# EAGLE design MSO-demo-board (EAGLE 6.5.0)
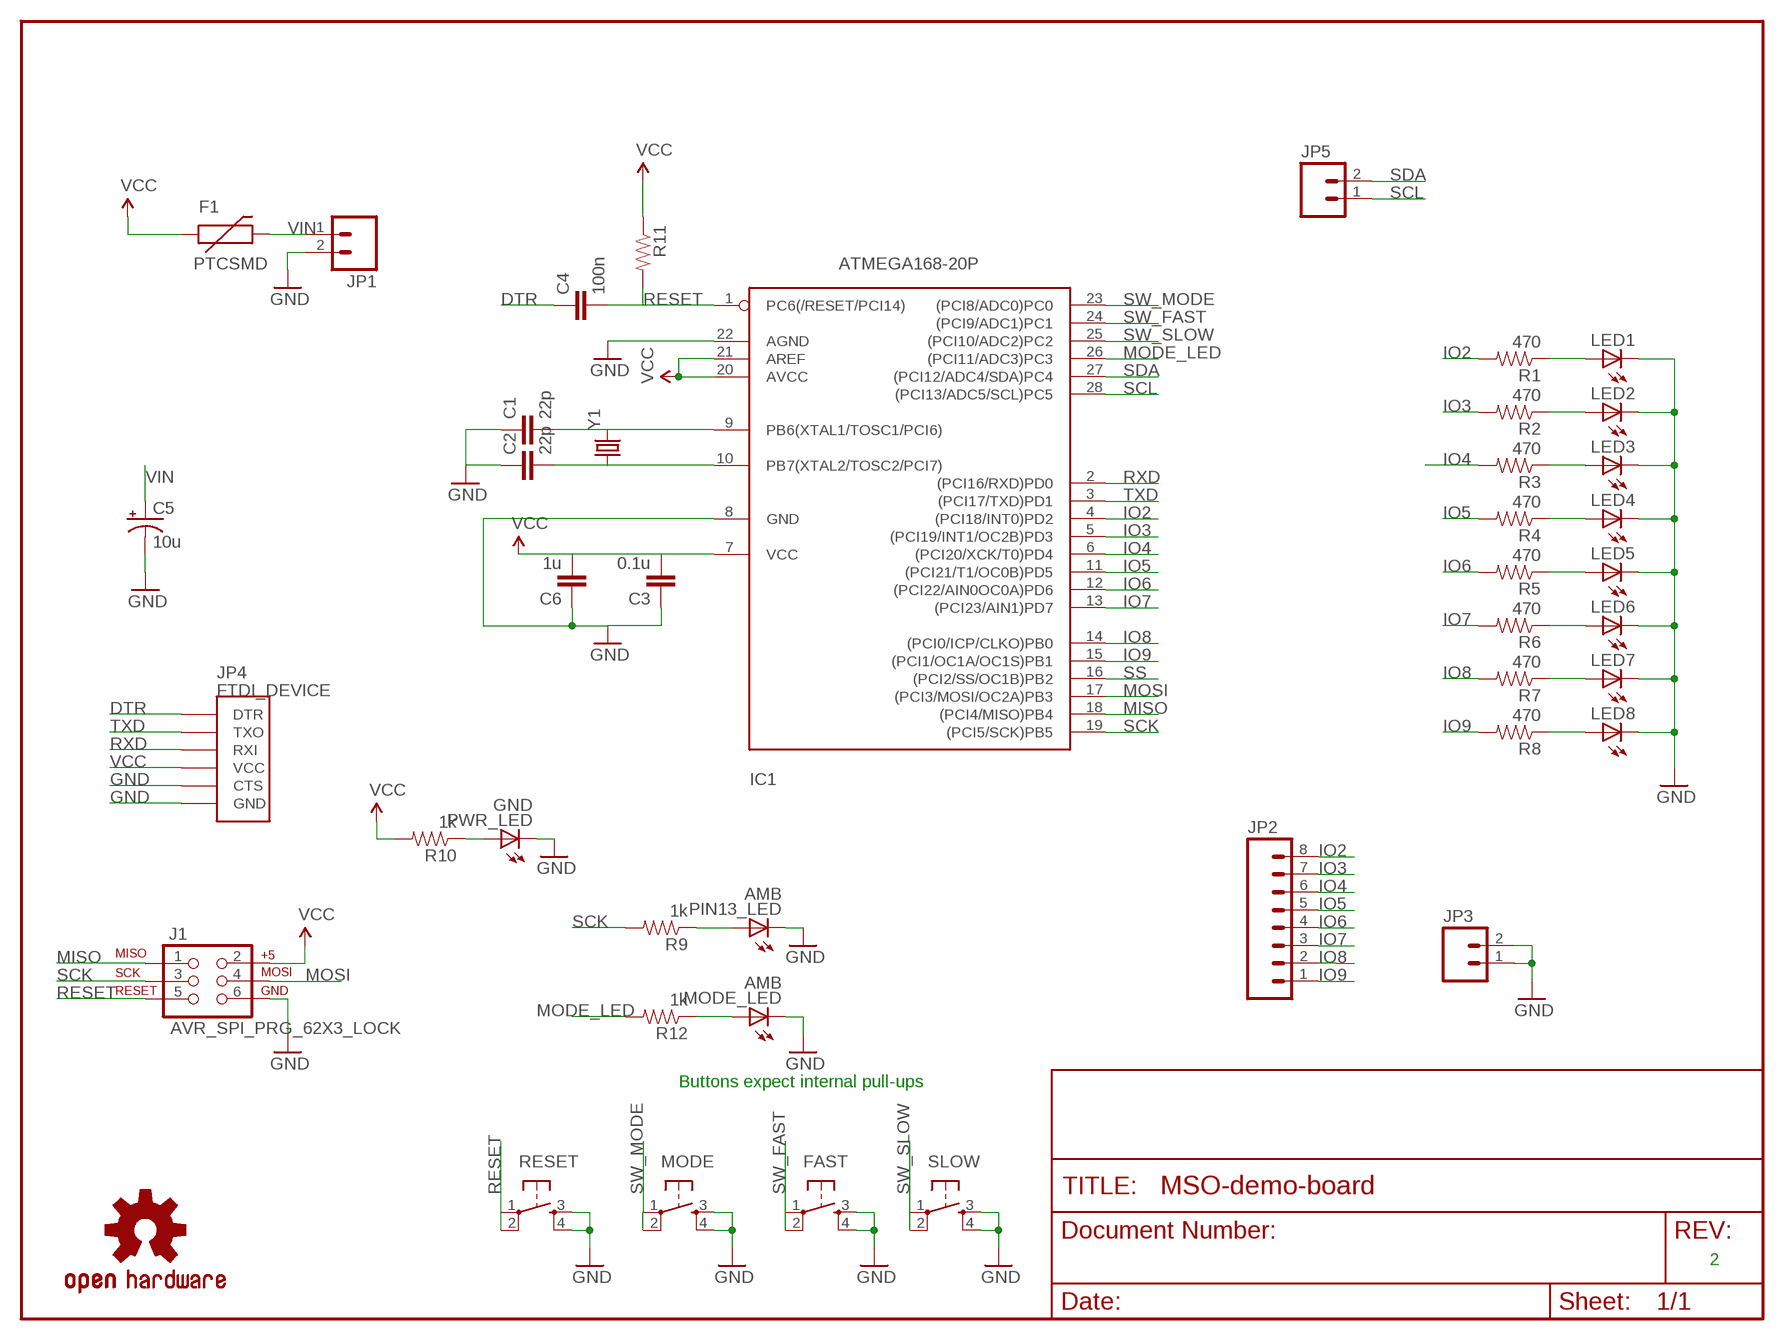
[diagram p0: schematic, sheet 1]

## Parts
C1  22p  CAP1206  [1206]
C2  22p  CAP1206  [1206]
C3  0.1u  CAP1206  [1206]
C4  100n  CAP1206  [1206]
C5  10u  CPOL-USCT7343  [CT7343]
C6  1u  CAP1206  [1206]
F1  PTCSMD  [PTC-1206]
FAST  TAC_SWITCHSMD  [TACTILE_SWITCH_SMD]
IC1  ATMEGA168-20P  [DIL28-3]
J1  AVR_SPI_PRG_62X3_LOCK  [2X3_LOCK]
JP1  M02LOCK  [1X02_LOCK]
JP2  M08LOCK  [1X08_LOCK]
JP3  M02LOCK  [1X02_LOCK]
JP4  FTDI_DEVICE  [FTDI_DEVICE_SIDE]
JP5  M02LOCK  [1X02_LOCK]
LED1  LED1206  [LED-1206]
LED2  LED1206  [LED-1206]
LED3  LED1206  [LED-1206]
LED4  LED1206  [LED-1206]
LED5  LED1206  [LED-1206]
LED6  LED1206  [LED-1206]
LED7  LED1206  [LED-1206]
LED8  LED1206  [LED-1206]
MODE  TAC_SWITCHSMD  [TACTILE_SWITCH_SMD]
MODE_LED  AMB  LED1206  [LED-1206]
PIN13_LED  AMB  LED1206  [LED-1206]
PWR_LED  GND  LED1206  [LED-1206]
R1  470  RESISTOR1206  [1206]
R2  470  RESISTOR1206  [1206]
R3  470  RESISTOR1206  [1206]
R4  470  RESISTOR1206  [1206]
R5  470  RESISTOR1206  [1206]
R6  470  RESISTOR1206  [1206]
R7  470  RESISTOR1206  [1206]
R8  470  RESISTOR1206  [1206]
R9  1k  RESISTOR1206  [1206]
R10  1k  RESISTOR1206  [1206]
R11  RESISTOR1206  [1206]
R12  1k  RESISTOR1206  [1206]
RESET  TAC_SWITCHSMD  [TACTILE_SWITCH_SMD]
SLOW  TAC_SWITCHSMD  [TACTILE_SWITCH_SMD]
U$1  OSHW-LOGOS  [OSHW-LOGO-S]
Y1  CRYSTALHC49UV  [HC49U-V]

## Nets
DTR: C4.1 JP4.P$1(DTR)
GND: C1.1 C2.1 C3.1 C5.- C6.1 FAST.3 FAST.4 IC1.8(GND) IC1.22(AGND) J1.6 JP1.2 JP3.1 JP3.2 JP4.P$5(CTS) JP4.P$6(GND) LED1.C LED2.C LED3.C LED4.C LED5.C LED6.C LED7.C LED8.C MODE.3 MODE.4 MODE_LED.C PIN13_LED.C PWR_LED.C RESET.3 RESET.4 SLOW.3 SLOW.4
IO2: IC1.4((PCI18/INT0)PD2) JP2.8 R1.2
IO3: IC1.5((PCI19/INT1/OC2B)PD3) JP2.7 R2.2
IO4: IC1.6((PCI20/XCK/T0)PD4) JP2.6 R3.2
IO5: IC1.11((PCI21/T1/OC0B)PD5) JP2.5 R4.2
IO6: IC1.12((PCI22/AIN0OC0A)PD6) JP2.4 R5.2
IO7: IC1.13((PCI23/AIN1)PD7) JP2.3 R6.2
IO8: IC1.14((PCI0/ICP/CLKO)PB0) JP2.2 R7.2
IO9: IC1.15((PCI1/OC1A/OC1S)PB1) JP2.1 R8.2
MISO: IC1.18((PCI4/MISO)PB4) J1.1
MODE_LED: IC1.26((PCI11/ADC3)PC3) R12.2
MOSI: IC1.17((PCI3/MOSI/OC2A)PB3) J1.4
N$1: PWR_LED.A R10.1
N$2: C1.2 IC1.9(PB6(XTAL1/TOSC1/PCI6)) Y1.2
N$3: C2.2 IC1.10(PB7(XTAL2/TOSC2/PCI7)) Y1.1
N$4: MODE_LED.A R12.1
N$11: PIN13_LED.A R9.1
N$13: LED1.A R1.1
N$14: LED3.A R3.1
N$15: LED2.A R2.1
N$16: LED4.A R4.1
N$17: LED5.A R5.1
N$18: LED6.A R6.1
N$19: LED7.A R7.1
N$20: LED8.A R8.1
RESET: C4.2 IC1.1(PC6(/RESET/PCI14)) J1.5 R11.2 RESET.1 RESET.2
RXD: IC1.2((PCI16/RXD)PD0) JP4.P$3(RXI)
SCK: IC1.19((PCI5/SCK)PB5) J1.3 R9.2
SCL: IC1.28((PCI13/ADC5/SCL)PC5) JP5.1
SDA: IC1.27((PCI12/ADC4/SDA)PC4) JP5.2
SS: IC1.16((PCI2/SS/OC1B)PB2)
SW_FAST: FAST.1 FAST.2 IC1.24((PCI9/ADC1)PC1)
SW_MODE: IC1.23((PCI8/ADC0)PC0) MODE.1 MODE.2
SW_SLOW: IC1.25((PCI10/ADC2)PC2) SLOW.1 SLOW.2
TXD: IC1.3((PCI17/TXD)PD1) JP4.P$2(TXO)
VCC: C3.2 C6.2 F1.1 IC1.7(VCC) IC1.20(AVCC) IC1.21(AREF) J1.2 JP4.P$4(VCC) R10.2 R11.1
VIN: C5.+ F1.2 JP1.1

## Notes on the sheet
- Buttons expect internal pull-ups
- 2

## Library data of the parts
C1-C4 C6 = Add-Ohms:CAP: Capacitor Standard 0603 ceramic capacitor, and 0.1" leaded capacitor.
C5 = adafruit:CPOL-US: POLARIZED CAPACITOR, American symbol
F1 = SparkFun:PTC: Resettable Fuse PTC Resettable Fuse. Spark Fun Electronics SKU : COM-08357
FAST MODE RESET SLOW = Add-Ohms:TAC_SWITCH: Momentary Switch Button commonly used for reset or general input. Spark Fun Electronics SKU : COM-00097
IC1 = adafruit:ATMEGA168*P: MICROCONTROLLER 16 kBytes FLASH 1 kBytes SRAM 512 Bytes EEPROM USART 8-channel 10 bit ADC
J1 = SparkFun:AVR_SPI_PRG_6: AVR ISP 6 Pin This is the reduced ISP connector for AVR programming. Common on Arduino. This footprint will take up less PCB space and can be used with a 10-pin to 6-pin adapter such as SKU: BOB-08508
JP1 JP3 JP5 = SparkFun:M02: Header 2 Standard 2-pin 0.1" header. Use with straight break away headers (SKU : PRT-00116), right angle break away headers (PRT-00553), swiss pins (PRT-00743), machine pins (PRT-00117), and female headers (PRT-00115). Molex polarized connector foot print use with SKU : PRT-08233 with associated crimp pins and housings.
JP2 = SparkFun:M08: Header 8 Standard 8-pin 0.1" header. Use with straight break away headers (SKU : PRT-00116), right angle break away headers (PRT-00553), swiss pins (PRT-00743), machine pins (PRT-00117), and female headers (PRT-00115).
JP4 = SparkFun-Connectors:FTDI_DEVICE: Connector which mates to FTDI basic or FTDI cable.
LED1-LED8 MODE_LED PIN13_LED PWR_LED = LilyPad-Wearables:LED: LEDs Standard schematic elements and footprints for 5mm, 3mm, 1206, and 0603 sized LEDs. 5mm - Spark Fun Electronics SKU : Comp-SBL
R1-R12 = Add-Ohms:RESISTOR: Resistor Basic schematic elements and footprints for 0603, 1206, and PTH resistors.
U$1 = Add-Ohms:OSHW-LOGO: Open Source Hardware Logo This logo indicates the piece of hardware it is found on incorporates a OSHW license and/or adheres to the definition of open source hardware found here: http://freedomdefined.org/OSHW
Y1 = SparkFun:CRYSTAL: Crystals Various standard crystals. Proven footprints. Spark Fun Electronics SKU : COM-00534

## Board
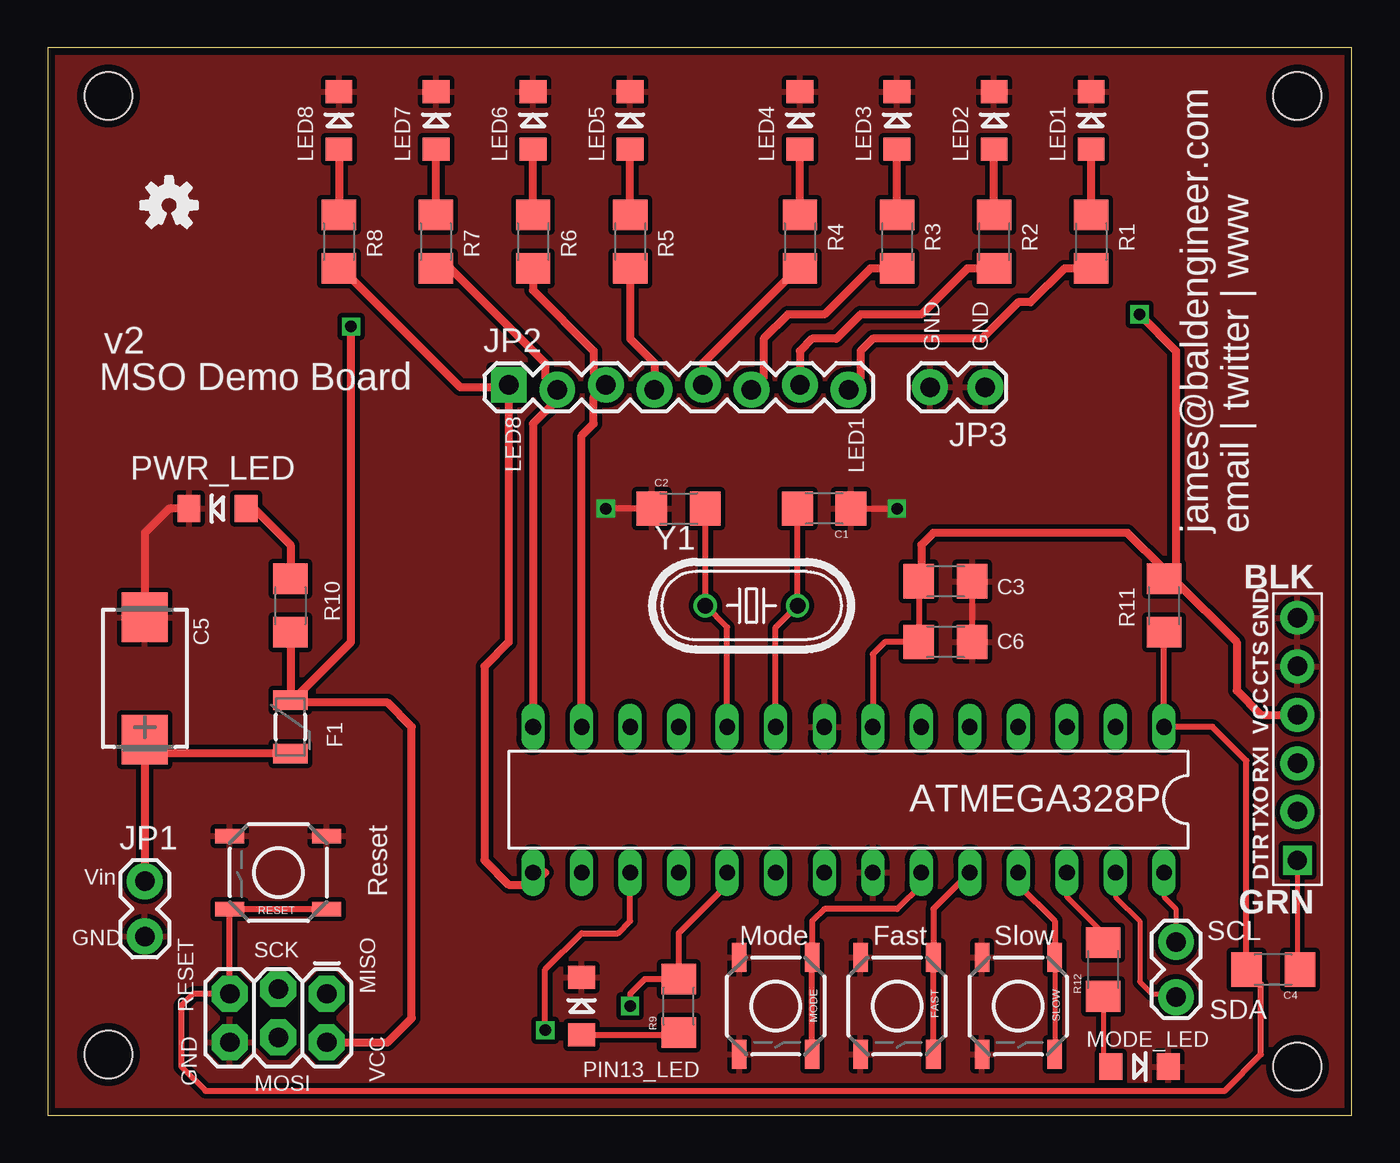
[diagram p1: board, top side]
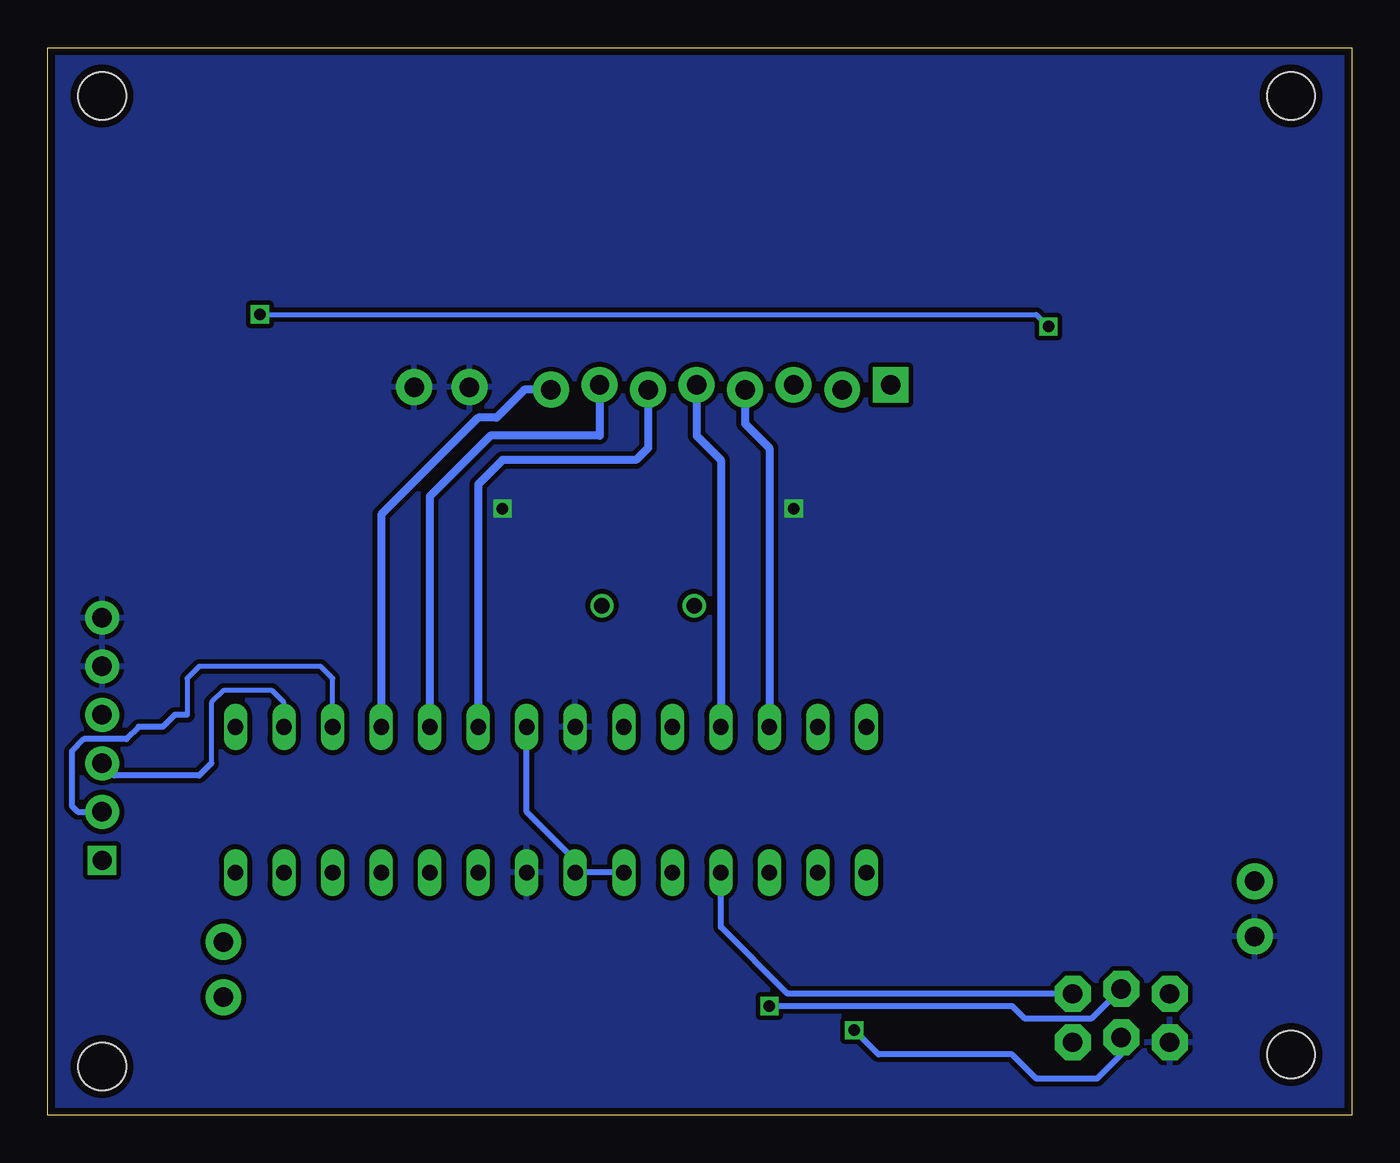
[diagram p2: board, bottom side, seen from below]

Size 68.25 x 55.87 mm. Coordinates in mm from the lower left corner, seen from the top.
Outline: 0,0 68.25,0 68.25,55.87 0,55.87 0,0
Copper layers (1*16): Top 0.0356mm / dielectric 1.5011mm / Bottom 0.0356mm
Design rules "LaenPCBOrder": minimum track width 6mil, minimum drill 13mil, track to track 6mil, track to pad 6mil, pad to pad 6mil, via to via 6mil, smd to smd 6mil, copper to edge 15mil, drill to drill 6mil, minimum pad ring 7mil, minimum via ring 7mil, stop-mask expansion 4mil, vias tented up to drill 0mil, thermal gap 10mil
Holes 2.5 mm at 3.17,3.17 3.17,53.34 65.41,53.34 65.41,2.54

### Footprints (pad centres in the part's own frame; a part is rotated, then mirrored left to right if it is on the bottom)
1206 = smd 1.6 x 1.8: 1 -1.4,0; 2 1.4,0
CT7343 = smd 2.6 x 2.4: + 3.2,0; - -3.2,0
PTC-1206 = smd 1 x 1.8: 1 -1.4,0; 2 1.4,0
TACTILE_SWITCH_SMD = smd 1.524 x 0.762: 1 -2.54,1.905; 2 2.54,1.905; 3 -2.54,-1.905; 4 2.54,-1.905
DIL28-3 = drill 0.813 long: 1 -16.51,-3.81; 2 -13.97,-3.81; 3 -11.43,-3.81; 4 -8.89,-3.81; 5 -6.35,-3.81; 6 -3.81,-3.81; 7 -1.27,-3.81; 8 1.27,-3.81; 9 3.81,-3.81; 10 6.35,-3.81; 11 8.89,-3.81; 12 11.43,-3.81; 13 13.97,-3.81; 14 16.51,-3.81; 15 16.51,3.81; 16 13.97,3.81; 17 11.43,3.81; 18 8.89,3.81; 19 6.35,3.81; 20 3.81,3.81; 21 1.27,3.81; 22 -1.27,3.81; 23 -3.81,3.81; 24 -6.35,3.81; 25 -8.89,3.81; 26 -11.43,3.81; 27 -13.97,3.81; 28 -16.51,3.81
2X3_LOCK = drill 1.016 pad 1.88 octagon: 1 0,0; 2 0,2.54; 3 2.54,-0.254; 4 2.54,2.286; 5 5.08,0; 6 5.08,2.54
1X02_LOCK = drill 1.016 pad 1.88: 1 -0.178,0; 2 2.718,0
1X08_LOCK = drill 1.016 pad 1.88 square: 1 0,0.127 | drill 1.016 pad 1.88: 2 2.54,-0.127; 3 5.08,0.127; 4 7.62,-0.127; 5 10.16,0.127; 6 12.7,-0.127; 7 15.24,0.127; 8 17.78,-0.127
FTDI_DEVICE_SIDE = drill 1 square: P$1 -6.35,0 | drill 1.016 pad 1.778: P$2 -3.81,0; P$3 -1.27,0; P$4 1.27,0; P$5 3.81,0; P$6 6.35,0
LED-1206 = smd 1.2 x 1.4: A -1.5,0; C 1.5,0
HC49U-V = drill 0.813: 1 -2.413,0; 2 2.413,0

### Placement (x,y rotation side)
C1  40.64,31.75 180 top
C2  33.02,31.75 0 top
C3  46.99,27.94 180 top
C4  64.14,7.62 180 top
C5  5.08,22.86 270 top
C6  46.99,24.77 180 top
F1  12.7,20.32 270 top
FAST  44.45,5.71 270 top
IC1  41.91,16.51 180 top
J1  14.61,6.35 180 top
JP1  5.08,12.06 270 top
JP2  24.13,38.1 0 top
JP3  48.9,38.1 180 top
JP4  65.41,19.68 90 top
JP5  59.05,8.89 270 top
LED1  54.61,52.07 90 top
LED2  49.53,52.07 90 top
LED3  44.45,52.07 90 top
LED4  39.37,52.07 90 top
LED5  30.48,52.07 90 top
LED6  25.4,52.07 90 top
LED7  20.32,52.07 90 top
LED8  15.24,52.07 90 top
MODE  38.1,5.71 270 top
MODE_LED  57.15,2.54 0 top
PIN13_LED  27.94,5.71 90 top
PWR_LED  8.89,31.75 180 top
R1  54.61,45.72 270 top
R2  49.53,45.72 270 top
R3  44.45,45.72 270 top
R4  39.37,45.72 270 top
R5  30.48,45.72 270 top
R6  25.4,45.72 270 top
R7  20.32,45.72 270 top
R8  15.24,45.72 270 top
R9  33.02,5.71 90 top
R10  12.7,26.67 270 top
R11  58.42,26.67 270 top
R12  55.24,7.62 90 top
RESET  12.06,12.7 180 top
SLOW  50.8,5.71 270 top
U$1  6.35,47.62 0 top
Y1  36.83,26.67 0 top

### Tracks (layer width: path | path; a pad name or v marks a point on that pad's centre or on a via)
DTR
  Top 0.254: JP4.P$1 65.41,7.75 C4.1
GND  (via drill 0.6)
  Top 0.305: C2.1 v29.21,31.75 | C1.1 v44.45,31.75 | C6.1 C3.1
  Top 0.406: PWR_LED.C 6.35,31.75 5.08,30.48 C5.-
  pour Top (isolate 0.254): 0,55.88 68.58,55.88 67.94,0 0,0
  pour Bottom (isolate 0.254): 0,55.88 68.58,55.88 68.58,0 0,0
IO2
  Top 0.406: R1.2 53.21,44.32 51.44,42.55 50.8,42.55 48.9,40.64 43.18,40.64 42.55,40.01 42.55,38.61 JP2.8
  Bottom 0.406: JP2.8 43.31,37.97 44.77,36.51 45.72,36.51 50.8,31.43 IC1.4
IO3
  Top 0.406: R2.2 48.13,44.32 45.72,41.91 42.55,41.91 41.27,40.64 40.01,40.64 39.37,40.01 JP2.7
  Bottom 0.406: JP2.7 39.37,35.56 45.09,35.56 48.26,32.38 IC1.5
IO4
  Top 0.406: R3.2 43.05,44.32 40.64,41.91 38.73,41.91 37.47,40.64 37.47,38.61 JP2.6
  Bottom 0.406: JP2.6 36.83,34.92 37.47,34.29 44.45,34.29 45.72,33.02 IC1.6
IO5
  Top 0.406: R4.2 39.24,44.32 34.29,39.37 JP2.5
  Bottom 0.406: JP2.5 34.29,35.56 33.02,34.29 IC1.11
IO6
  Top 0.406: R5.2 30.48,40.64 31.75,39.37 JP2.4
  Bottom 0.406: JP2.4 31.75,36.2 30.48,34.92 IC1.12
IO7
  Top 0.406: R6.2 25.4,43.18 28.57,40.01 28.57,38.86 JP2.3 28.57,37.59 28.57,36.2 27.94,35.56 IC1.13
IO8
  Top 0.406: R7.2 21.09,44.32 26.04,39.37 26.04,38.61 JP2.2 26.67,37.47 25.4,36.2 IC1.14
IO9
  Top 0.406: R8.2 15.37,44.32 21.59,38.1 24,38.1 JP2.1 24.13,24.77 22.86,23.5 22.86,13.34 24.13,12.06 25.4,12.06 26.04,12.7 IC1.15
MISO
  Bottom 0.305: J1.1 29.53,6.35 33.02,9.84 IC1.18
MODE_LED
  Top 0.254: IC1.26 53.34,11.43 55.24,9.53 R12.2
MOSI  (via drill 0.6)
  Top 0.305: v26.04,4.45 26.04,7.62 27.94,9.53 29.84,9.53 30.48,10.16 IC1.17
  Bottom 0.305: J1.4 12.06,3.17 13.34,1.91 16.51,1.91 17.78,3.17 24.77,3.17 v26.04,4.45
N$1
  Top 0.406: PWR_LED.A 10.79,31.75 12.7,29.84 R10.1
N$2
  Top 0.305: IC1.9 38.1,25.53 Y1.2 C1.2
N$3
  Top 0.305: IC1.10 35.56,25.53 Y1.1 C2.2
N$4
  Top 0.254: R12.1 55.24,2.94 MODE_LED.A
N$11
  Top 0.305: PIN13_LED.A 32.92,4.21 R9.1
N$13
  Top 0.406: R1.1 LED1.A
N$14
  Top 0.406: R3.1 LED3.A
N$15
  Top 0.406: R2.1 LED2.A
N$16
  Top 0.406: R4.1 LED4.A
N$17
  Top 0.406: R5.1 LED5.A
N$18
  Top 0.406: R6.1 LED6.A
N$19
  Top 0.406: 20.32,50.16 LED7.A R7.1
N$20
  Top 0.406: LED8.A R8.1
RESET
  Top 0.305: R11.2 IC1.1 60.96,20.32 62.73,18.55 C4.2 63.5,6.86 63.5,3.17 61.59,1.27 8.26,1.27 6.99,2.54 6.99,5.71 7.62,6.35 J1.5 RESET.2 RESET.1
RXD
  Bottom 0.254: IC1.2 55.88,21.59 56.52,22.23 59.05,22.23 59.69,21.59 59.69,18.41
  Bottom 0.305: 59.69,18.41 60.33,17.78 64.77,17.78 JP4.P$3
SCK  (via drill 0.6)
  Top 0.305: IC1.19 35.56,12.06 33.02,9.53 R9.2 31.25,7.12 30.48,6.35 v30.48,5.71
  Bottom 0.305: v30.48,5.71 17.78,5.71 17.14,5.08 13.59,5.08 J1.3
SCL
  Top 0.254: IC1.28 58.42,11.43 59.05,10.79 JP5.1
SDA
  Top 0.254: IC1.27 55.88,11.43 57.15,10.16 57.15,6.99 57.78,6.35 58.88,6.35 JP5.2
SW_FAST
  Top 0.305: IC1.24 46.35,10.79 FAST.1 FAST.2
SW_MODE
  Top 0.305: MODE.2 MODE.1 40.01,10.16 40.64,10.79 44.45,10.79 45.72,12.06 IC1.23
SW_SLOW
  Top 0.254: SLOW.1 SLOW.2
  Top 0.305: IC1.25 50.8,12.06 52.7,10.16 SLOW.1
TXD
  Bottom 0.254: IC1.3 53.34,22.86 53.98,23.5 60.33,23.5 60.96,22.86 60.96,20.95
  Bottom 0.305: 60.96,20.95 61.59,20.95 62.23,20.32 63.5,20.32 64.14,19.68 66.36,19.68 66.99,19.05 66.99,16.19 66.67,15.88 JP4.P$2
VCC  (via drill 0.6)
  Top 0.254: 12.7,21.59 F1.1 | 58.42,27.94 R11.1
  Top 0.305: IC1.7 43.18,24.13 43.81,24.77 C6.2 C3.2
  Top 0.406: J1.2 17.78,3.81 19.05,5.08 19.05,20.32 17.78,21.59 12.83,21.59 F1.1 R10.2 | JP4.P$4 63.5,20.95 62.23,22.23 62.23,24.77 58.92,28.07 R11.1 58.42,28.57 56.52,30.48 46.35,30.48 45.72,29.84 45.72,28.07 C3.2 | 12.7,21.59 15.88,24.77 v15.88,41.27 | v57.15,41.91 59.05,40.01 59.05,28.57 58.42,27.94
  Bottom 0.254: v57.15,41.91 16.51,41.91 v15.88,41.27
  Bottom 0.305: IC1.20 IC1.21 40.64,13.34 43.18,15.88 IC1.7
VIN
  Top 0.406: F1.2 5.82,18.92 C5.+ JP1.1

### Text on the board
tNames: v2 | GND | GND | MSO Demo Board | LED1 | LED8 | james@baldengineer.com / email | twitter | www | ATMEGA328P | Vin | Reset | SCL | GND | Mode | Fast | Slow | SCK | MISO | SDA | RESET | GND | VCC | MOSI